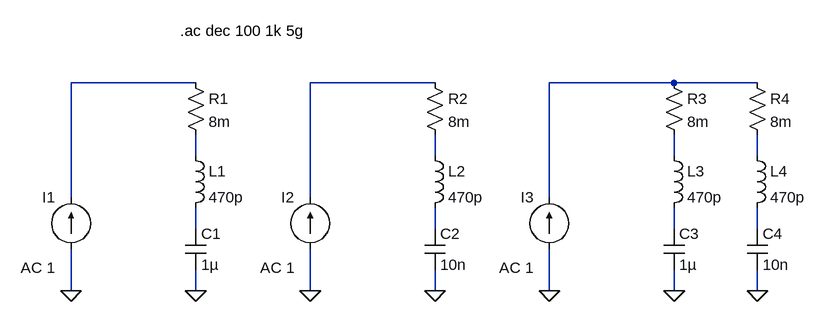
[diagram p0: schematic why_use_many_capacitor_in_parallels.asc]
why_use_many_capacitor_in_parallels.asc, the LTspice schematic file:
Version 4
SHEET 1 1320 680
WIRE 336 32 144 32
WIRE 704 32 512 32
WIRE 1072 32 880 32
WIRE 1200 32 1072 32
WIRE 336 144 336 112
WIRE 704 144 704 112
WIRE 1072 144 1072 112
WIRE 1200 144 1200 112
WIRE 144 208 144 32
WIRE 512 208 512 32
WIRE 880 208 880 32
WIRE 336 256 336 224
WIRE 704 256 704 224
WIRE 1072 256 1072 224
WIRE 1200 256 1200 224
WIRE 144 352 144 288
WIRE 336 352 336 320
WIRE 512 352 512 288
WIRE 704 352 704 320
WIRE 880 352 880 288
WIRE 1072 352 1072 320
WIRE 1200 352 1200 320
FLAG 144 352 0
FLAG 336 352 0
FLAG 512 352 0
FLAG 704 352 0
FLAG 880 352 0
FLAG 1072 352 0
FLAG 1200 352 0
SYMBOL current 144 288 R180
WINDOW 0 24 80 Left 2
WINDOW 3 24 0 Left 2
WINDOW 123 24 -28 Left 2
WINDOW 39 0 0 Left 0
SYMATTR InstName I1
SYMATTR Value ""
SYMATTR Value2 AC 1
SYMBOL cap 320 256 R0
SYMATTR InstName C1
SYMATTR Value 1µ
SYMBOL res 320 16 R0
SYMATTR InstName R1
SYMATTR Value 8m
SYMBOL ind 320 128 R0
SYMATTR InstName L1
SYMATTR Value 470p
SYMBOL cap 688 256 R0
SYMATTR InstName C2
SYMATTR Value 10n
SYMBOL res 688 16 R0
SYMATTR InstName R2
SYMATTR Value 8m
SYMBOL ind 688 128 R0
SYMATTR InstName L2
SYMATTR Value 470p
SYMBOL cap 1056 256 R0
SYMATTR InstName C3
SYMATTR Value 1µ
SYMBOL res 1056 16 R0
SYMATTR InstName R3
SYMATTR Value 8m
SYMBOL ind 1056 128 R0
SYMATTR InstName L3
SYMATTR Value 470p
SYMBOL cap 1184 256 R0
SYMATTR InstName C4
SYMATTR Value 10n
SYMBOL res 1184 16 R0
SYMATTR InstName R4
SYMATTR Value 8m
SYMBOL ind 1184 128 R0
SYMATTR InstName L4
SYMATTR Value 470p
SYMBOL current 512 288 R180
WINDOW 0 24 80 Left 2
WINDOW 3 24 0 Left 2
WINDOW 123 24 -28 Left 2
WINDOW 39 0 0 Left 0
SYMATTR InstName I2
SYMATTR Value ""
SYMATTR Value2 AC 1
SYMBOL current 880 288 R180
WINDOW 0 24 80 Left 2
WINDOW 3 24 0 Left 2
WINDOW 123 24 -28 Left 2
WINDOW 39 0 0 Left 0
SYMATTR InstName I3
SYMATTR Value ""
SYMATTR Value2 AC 1
TEXT 312 -48 Left 2 !.ac dec 100 1k 5g

The netlist it stands for:
* why_use_many_capacitor_in_parallels.asc
I1 0 N001 AC 1
C1 N008 0 1µ
R1 N001 N004 8m
L1 N004 N008 470p
C2 N009 0 10n
R2 N002 N005 8m
L2 N005 N009 470p
C3 N010 0 1µ
R3 N003 N006 8m
L3 N006 N010 470p
C4 N011 0 10n
R4 N003 N007 8m
L4 N007 N011 470p
I2 0 N002 AC 1
I3 0 N003 AC 1
.ac dec 100 1k 5g
.backanno
.end